# EAGLE design ownduino (EAGLE 6.1)
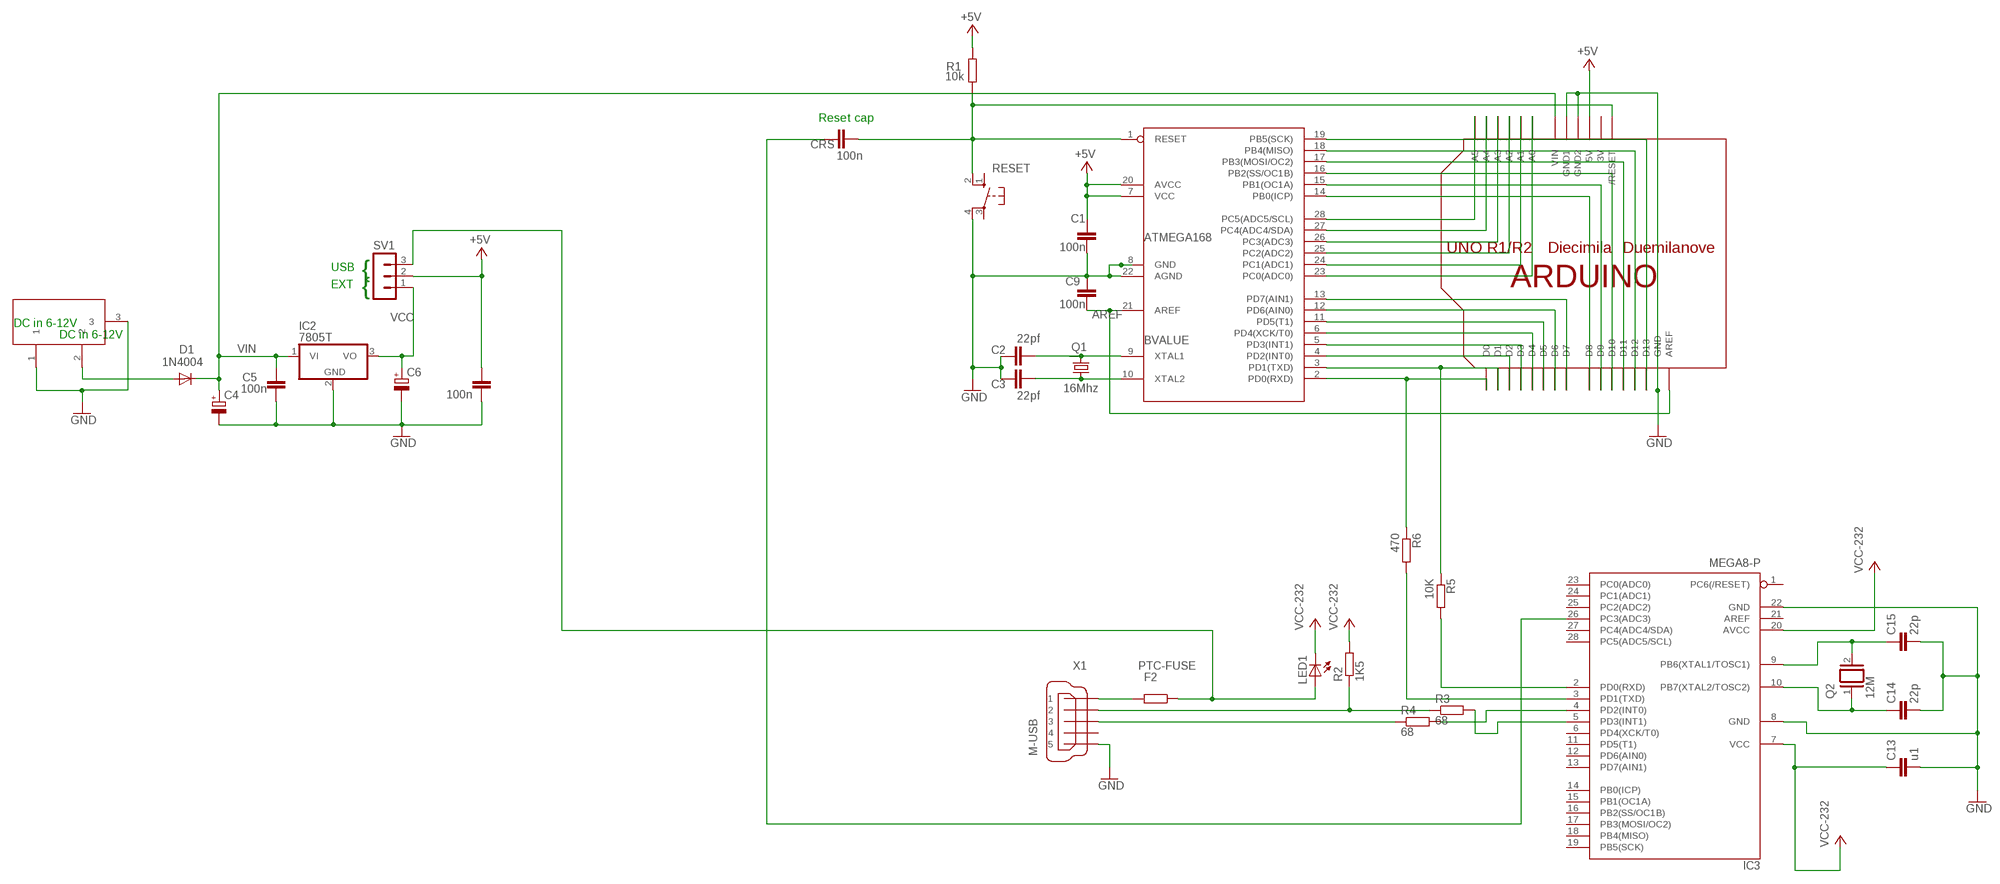
[diagram p0: schematic, sheet 1]

## Parts
BVALUE  ATMEGA168  MEGA8-P  [DIL28-3]
C1  100n  C-EU025-024X044  [C025-024X044]
C2  22pf  C-EU025-024X044  [C025-024X044]
C3  22pf  C-EU025-024X044  [C025-024X044]
C4  CPOL-EUE2.5-6  [E2,5-6]
C5  100n  C-EU025-024X044  [C025-024X044]
C6  CPOL-EUE2.5-6  [E2,5-6]
C9  100n  C-EU025-024X044  [C025-024X044]
C10  100n  C-EU025-024X044  [C025-024X044]
C13  u1  C-EU025-024X044  [C025-024X044]
C14  22p  C-EU025-024X044  [C025-024X044]
C15  22p  C-EU025-024X044  [C025-024X044]
CRS  100n  C-EU025-024X044  [C025-024X044]
D1  1N4004  DIODEPTH  [DIODE-0.4]
DC1  9V in  DC21MMX  [DC-21MM]
F2  PTC-FUSE  R-EU_0204/5  [0204/5]
IC2  7805T  [TO220H]
IC3  MEGA8-P  [DIL28-3]
LED1  LED3MM  [LED3MM]
Q1  16Mhz  CRYSTALHC49U-V  [HC49U-V]
Q2  12M  XTAL/S  [QS]
R1  10k  R-EU_0204/7  [0204/7]
R2  1K5  R-EU_0204/2V  [0204V]
R3  68  R-EU_0204/2V  [0204V]
R4  68  R-EU_0204/5  [0204/5]
R5  10K  R-EU_0204/7  [0204/7]
R6  470  R-EU_0204/7  [0204/7]
RESET  10-XX  [B3F-10XX]
SV1  MA03-1  [MA03-1]
U$1  ARDUINOUNO  [ARDUINO]
X1  M-USB  MINI-USB_SHIELD5P2-32005-601  [32005-601]

## Nets
+5V [power]: BVALUE.7(VCC) BVALUE.20(AVCC) C1.1 C10.2 R1.2 SV1.2 U$1.5V
A0: BVALUE.23(PC0(ADC0)) U$1.A0
A1: BVALUE.24(PC1(ADC1)) U$1.A1
A2: BVALUE.25(PC2(ADC2)) U$1.A2
A3: BVALUE.26(PC3(ADC3)) U$1.A3
A4: BVALUE.27(PC4(ADC4/SDA)) U$1.A4
A5: BVALUE.28(PC5(ADC5/SCL)) U$1.A5
AREF: BVALUE.21(AREF) C9.1 U$1.AREF
D0: BVALUE.2(PD0(RXD)) R6.1 U$1.D0
D1: BVALUE.3(PD1(TXD)) R5.1 U$1.D1
D2: BVALUE.4(PD2(INT0)) U$1.D2
D3: BVALUE.5(PD3(INT1)) U$1.D3
D4: BVALUE.6(PD4(XCK/T0)) U$1.D4
D5: BVALUE.11(PD5(T1)) U$1.D5
D6: BVALUE.12(PD6(AIN0)) U$1.D6
D7: BVALUE.13(PD7(AIN1)) U$1.D7
D8: BVALUE.14(PB0(ICP)) U$1.D8
D9: BVALUE.15(PB1(OC1A)) U$1.D9
D10: BVALUE.16(PB2(SS/OC1B)) U$1.D10
D11-MOSI: BVALUE.17(PB3(MOSI/OC2)) U$1.D11
D12-MISO: BVALUE.18(PB4(MISO)) U$1.D12
D13-SCK: BVALUE.19(PB5(SCK)) U$1.D13
D+: R4.1 X1.3
D-: R2.1 R3.1 X1.2
DTR: CRS.1 IC3.26(PC3(ADC3))
GND [power]: BVALUE.8(GND) BVALUE.22(AGND) C1.2 C2.1 C3.1 C4.- C5.1 C6.- C9.2 C10.1 C13.2 C14.2 C15.2 DC1.1 DC1.3 IC2.2(GND) IC3.8(GND) IC3.22(GND) RESET.4(P1) U$1.GND U$1.GND1 U$1.GND2 X1.5
N$1: C15.1 IC3.9(PB6(XTAL1/TOSC1)) Q2.2
N$4: C14.1 IC3.10(PB7(XTAL2/TOSC2)) Q2.1
N$6: BVALUE.9(XTAL1) C2.2 Q1.2
N$7 [power]: F2.1 LED1.A SV1.3
N$8 [power]: D1.A DC1.2
N$25: IC3.5(PD3(INT1)) R3.2
N$30: IC3.4(PD2(INT0)) R4.2
N$31: BVALUE.10(XTAL2) C3.2 Q1.1
N$33: IC3.2(PD0(RXD)) R5.2
N$35: IC3.3(PD1(TXD)) R6.2
N$38: F2.2 X1.1
RESET: BVALUE.1(RESET) CRS.2 R1.1 RESET.2(S1) U$1.RESET(/RESET)
VCC [power]: C6.+ C13.1 IC2.3(VO) IC3.7(VCC) IC3.20(AVCC) LED1.K(C) R2.2 SV1.1 ; supply symbol labelled VCC-232
VIN [power]: C4.+ C5.2 D1.C IC2.1(VI) U$1.VIN
Unconnected: IC3.1(PC6(/RESET)) IC3.6(PD4(XCK/T0)) IC3.11(PD5(T1)) IC3.12(PD6(AIN0)) IC3.13(PD7(AIN1)) IC3.14(PB0(ICP)) IC3.15(PB1(OC1A)) IC3.16(PB2(SS/OC1B)) IC3.17(PB3(MOSI/OC2)) IC3.18(PB4(MISO)) IC3.19(PB5(SCK)) IC3.21(AREF) IC3.23(PC0(ADC0)) IC3.24(PC1(ADC1)) IC3.25(PC2(ADC2)) IC3.27(PC4(ADC4/SDA)) IC3.28(PC5(ADC5/SCL)) RESET.1(S) RESET.3(P) X1.4 X1.M1(S1) X1.M2(S2)

## Notes on the sheet
- Reset cap
- USB
- {
- EXT
- {
- DC in 6-12V
- DC in 6-12V

## Power pins joined to a net without a drawn wire
3V: U$1.3V

## Library data of the parts
BVALUE = my-library:MEGA8-P: MICROCONTROLLER 8 Kbytes FLASH 1 kbytes SRAM 512 bytes EEPROM USART 4-channel 10 bit ADC 2-channel 8 bit ADC Source: avr.lbr
C1-C3 C5 C9 C10 C13-C15 CRS = rcl:C-EU: CAPACITOR, European symbol
C4 C6 = rcl:CPOL-EU: POLARIZED CAPACITOR, European symbol
D1 = SparkFunEagle-6-6-07:DIODE: Diode These are standard reverse protection diodes and small signal diodes. SMA package can handle up to about 1A. SOD-323 can handle about 200mA. What the SOD-323 package when ordering, there are some mfgs out there that are 5-pin packages.
DC1 = powersupply:DC21MM
F2 R1-R6 = rcl:R-EU_: RESISTOR, European symbol
IC2 = linear:78*: Positive VOLTAGE REGULATOR Source: http://cache.national.com/ds/LM/LM78L05.pdf http://www.fairchildsemi.com/ds/LM/LM7805.pdf
IC3 = atmel:MEGA8-P: MICROCONTROLLER 8 Kbytes FLASH, 1 kbytes SRAM, 512 bytes EEPROM, USART, 4-channel 10 bit ADC, 2-channel 8 bit ADC Pin compatible with Atmega48, ATMega88, ATMega168 Source: avr.lbr; OC_FARNELL: unknown; OC_NEWARK: unknown
LED1 = led:LED: LED OSRAM: - CHIPLED LG R971, LG N971, LY N971, LG Q971, LY Q971, LO R971, LY R971 LH N974, LH R974 LS Q976, LO Q976, LY Q976 LO Q996 - Hyper CHIPLED LW Q18S LB Q993, LB Q99A, LB R99A - SideLED LS A670, LO A670, LY A670, LG A670, LP A670 LB A673, LV A673, LT A673, LW A673 LH A674 LY A675 LS A676, LA A676, LO A676, LY A676, LW A676 LS A679, LY A679, LG A679 - Hyper Micro SIDELED® LS Y876, LA Y876, LO Y876, LY Y876 LT Y87S - SmartLED LW L88C, LW L88S LB L89C, LB L89S, LG L890 LS L89K, LO L89K, LY L89K LS L896, LA L896, LO L896, LY L896 - TOPLED LS T670, LO T670, LY T670, LG T670, LP T670 LSG T670, LSP T670, LSY T670, LOP T670, LYG T670 LG T671, LOG T671, LSG T671 LB T673, LV T673, LT T673, LW T673 LH T674 LS T676, LA T676, LO T676, LY T676, LB T676, LH T676, LSB T676, LW T676 LB T67C, LV T67C, LT T67C, LS T67K, LO T67K, LY T67K, LW E67C LS E67B, LA E67B, LO E67B, LY E67B, LB E67C, LV E67C, LT E67C LW T67C LS T679, LY T679, LG T679 LS T770, LO T770, LY T770, LG T770, LP T770 LB T773, LV T773, LT T773, LW T773 LH T774 LS E675, LA E675, LY E675, LS T675 LS T776, LA T776, LO T776, LY T776, LB T776 LHGB T686 LT T68C, LB T68C - Hyper Mini TOPLED® LB M676 - Mini TOPLED Santana® LG M470 LS M47K, LO M47K, LY M47K Source: http://www.osram.convergy.de LUXEON: - LUMILED® LXK2-PW12-R00, LXK2-PW12-S00, LXK2-PW14-U00, LXK2-PW14-V00 LXK2-PM12-R00, LXK2-PM12-S00, LXK2-PM14-U00 LXK2-PE12-Q00, LXK2-PE12-R00, LXK2-PE12-S00, LXK2-PE14-T00, LXK2-PE14-U00 LXK2-PB12-K00, LXK2-PB12-L00, LXK2-PB12-M00, LXK2-PB14-N00, LXK2-PB14-P00, LXK2-PB14-Q00 LXK2-PR12-L00, LXK2-PR12-M00, LXK2-PR14-Q00, LXK2-PR14-R00 LXK2-PD12-Q00, LXK2-PD12-R00, LXK2-PD12-S00 LXK2-PH12-R00, LXK2-PH12-S00 LXK2-PL12-P00, LXK2-PL12-Q00, LXK2-PL12-R00 Source: www.luxeon.com KINGBRIGHT: KA-3528ASYC Source: www.kingbright.com
Q1 = crystal:CRYSTAL: CRYSTAL
Q2 = special:XTAL/S: CRYSTAL
RESET = switch-omron:10-XX: OMRON SWITCH
SV1 = con-lstb:MA03-1: PIN HEADER
U$1 = adafruit:ARDUINO: Arduino Diecimila/Duemilanove Make a shield with ease, this package has all the named pins as well as the two mounting drill holes and an outline of the USB and DC power connector. The outline is on the DIMENSION layer, so if your board house uses it they will cut the outline to match. http://www.ladyada.net/library/pcb/eaglelibrary.html
X1 = con-cypressindustries:MINI-USB_SHIELD5P2-: MINI USB-B R/A DIP 5pol. Source: www.cypressindustries.com; OC_FARNELL: unknown; OC_NEWARK: unknown

## Net classes
0 default: width 0.203 mm, clearance 0.203 mm
1 power: width 0.6 mm, clearance 0.305 mm
2 finepitch: width 0.203 mm, clearance 0.203 mm

## Board
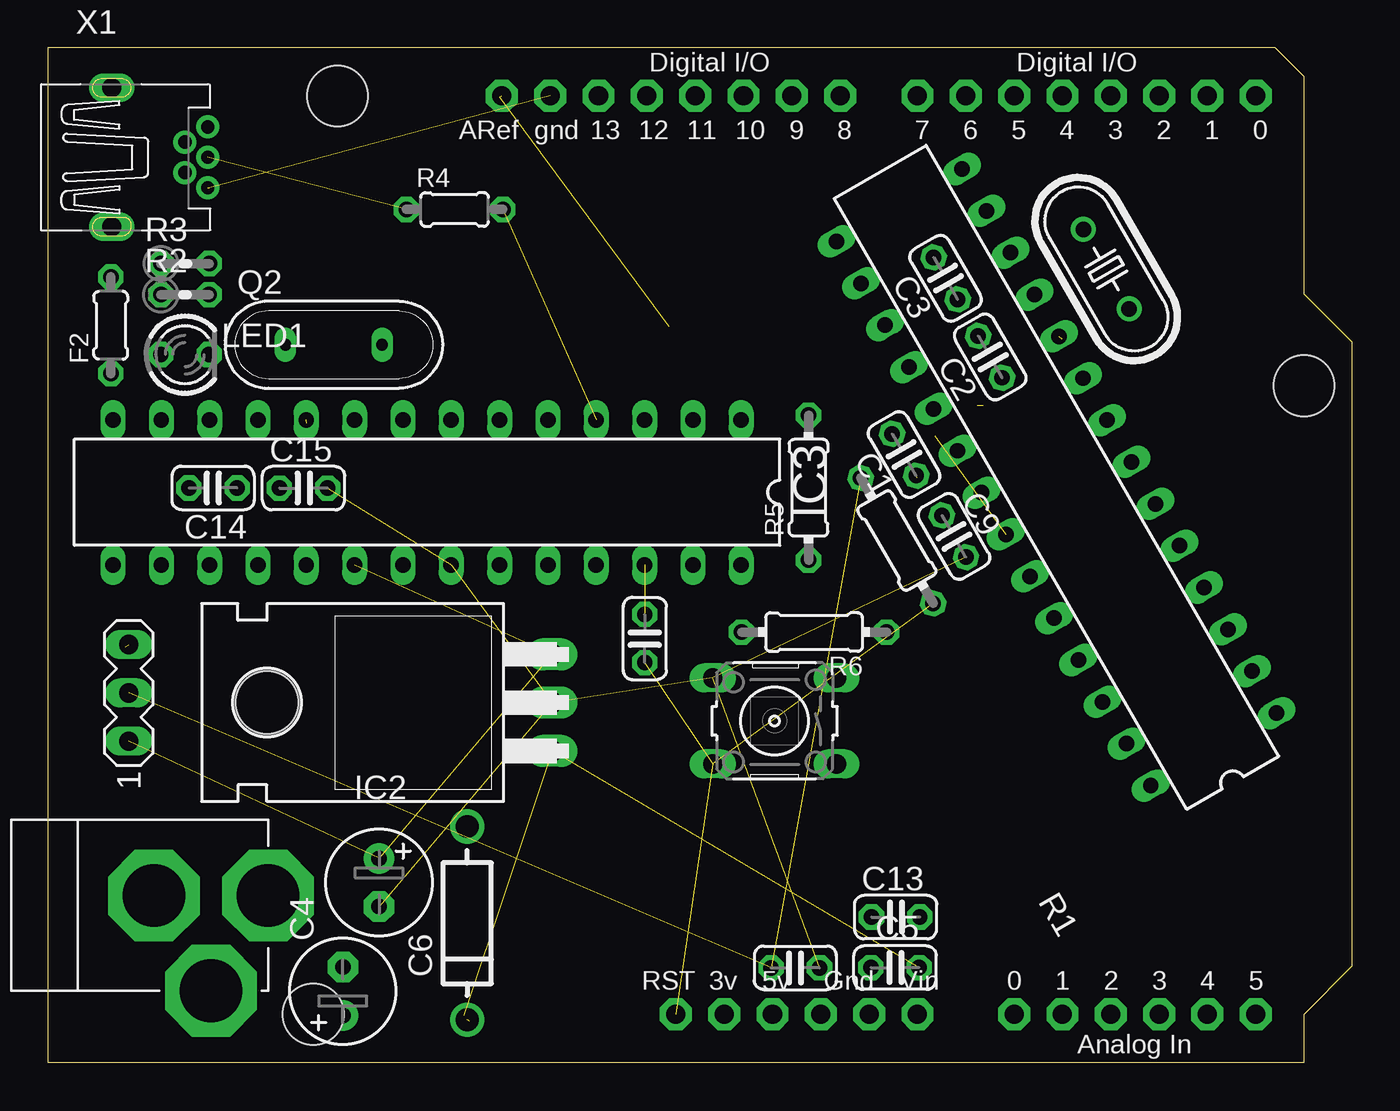
[diagram p1: board, top side]
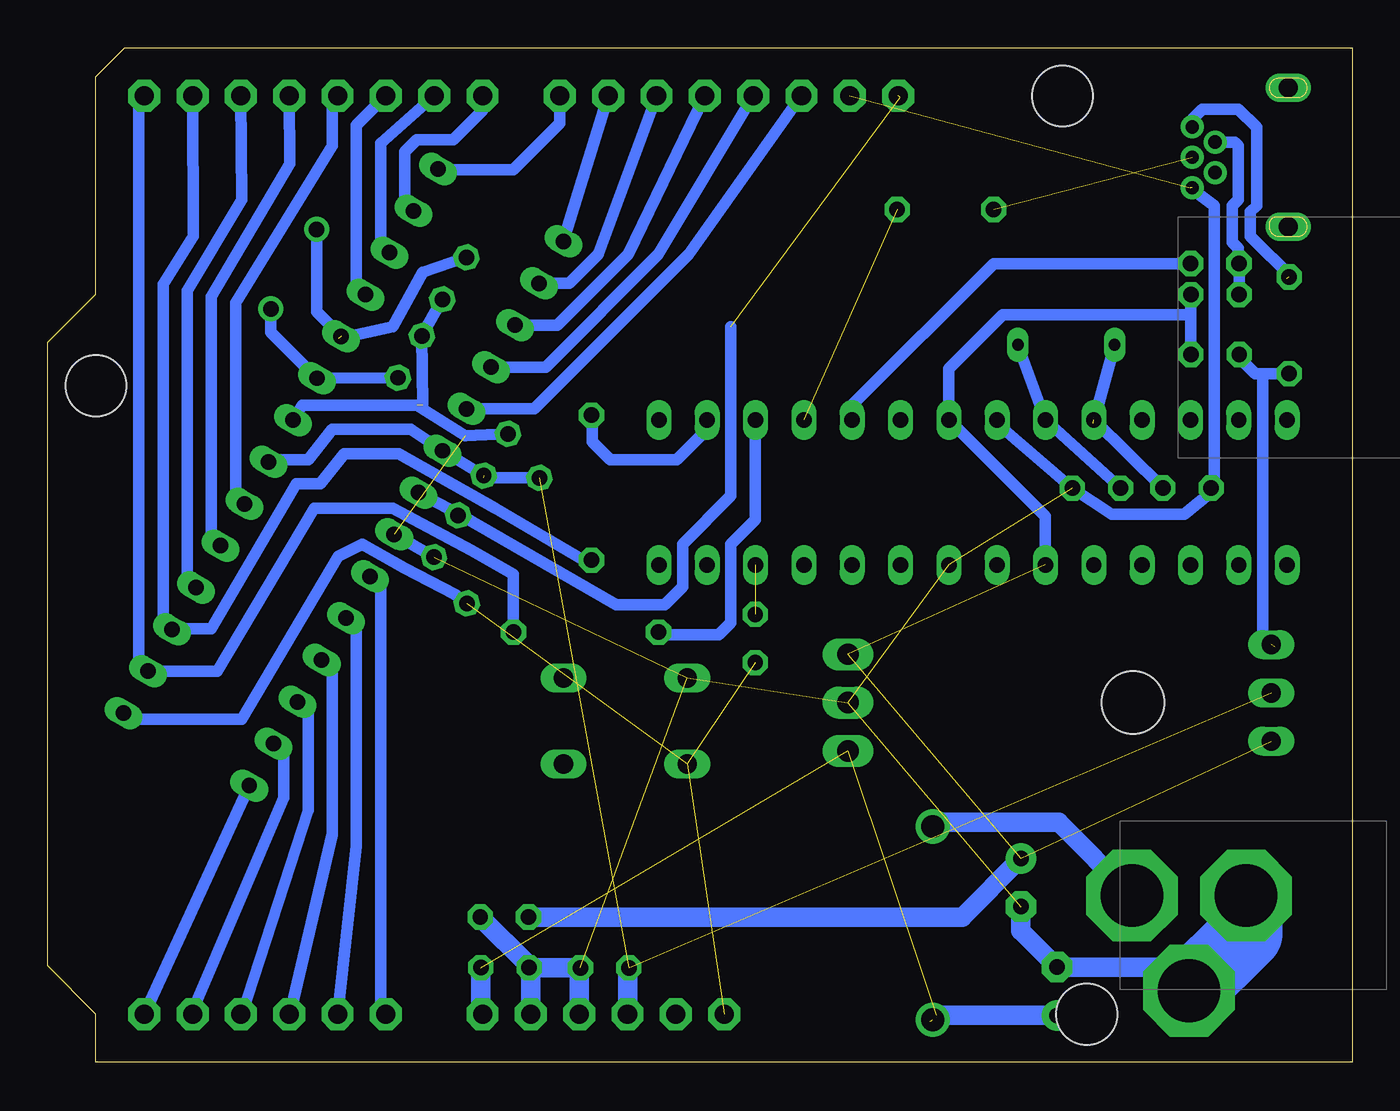
[diagram p2: board, bottom side, seen from below]

Size 68.58 x 53.34 mm. Coordinates in mm from the lower left corner, seen from the top.
Copper layers (1*16): Top 0.035mm / dielectric 1.5mm / Bottom 0.035mm
Design rules: minimum track width 10mil, minimum drill 0.6mm, track to track 8mil, track to pad 8mil, pad to pad 8mil, via to via 12mil, smd to smd 8mil, copper to edge 10mil, drill to drill 15mil, minimum pad ring 10mil, minimum via ring 12mil, stop-mask expansion 4mil, vias tented up to drill 0mil, thermal gap 10mil
Holes 3.2 mm at 67.03,138.64 67.03,110.7 16.23,153.88
tRestrict: area 14.3,152 to 18.1,155.8; area 65.1,136.7 to 68.9,140.5; area 65.1,108.8 to 68.9,112.6; 10 lines
bRestrict: area 14.3,152 to 18.1,155.8; area 65.1,136.7 to 68.9,140.5; area 65.1,108.8 to 68.9,112.6; 8 lines

### Footprints (pad centres in the part's own frame; a part is rotated, then mirrored left to right if it is on the bottom)
DIL28-3 = drill 0.813 long: 1 -16.51,-3.81; 2 -13.97,-3.81; 3 -11.43,-3.81; 4 -8.89,-3.81; 5 -6.35,-3.81; 6 -3.81,-3.81; 7 -1.27,-3.81; 8 1.27,-3.81; 9 3.81,-3.81; 10 6.35,-3.81; 11 8.89,-3.81; 12 11.43,-3.81; 13 13.97,-3.81; 14 16.51,-3.81; 15 16.51,3.81; 16 13.97,3.81; 17 11.43,3.81; 18 8.89,3.81; 19 6.35,3.81; 20 3.81,3.81; 21 1.27,3.81; 22 -1.27,3.81; 23 -3.81,3.81; 24 -6.35,3.81; 25 -8.89,3.81; 26 -11.43,3.81; 27 -13.97,3.81; 28 -16.51,3.81
C025-024X044 = drill 0.813 octagon: 1 -1.27,0; 2 1.27,0
E2,5-6 = drill 0.813 pad 1.6: + -1.27,0 | drill 0.813 pad 1.6 octagon: - 1.27,0
DIODE-0.4 = drill 1.2: A 0,0; C 10.16,0
DC-21MM = drill 3.302 pad 4.826 octagon: 1 -5.08,-3.353; 2 -0.076,-6.35; 3 -0.076,-0.356
0204/5 = drill 0.813 octagon: 1 -2.54,0; 2 2.54,0
TO220H = drill 1.118 long: 1 -2.54,-10.16; 2 0,-10.16; 3 2.54,-10.16 | hole 3.302: 0,4.826
LED3MM = drill 0.813 octagon: A -1.27,0; K 1.27,0
HC49U-V = drill 0.813: 1 -2.413,0; 2 2.413,0
QS = drill 0.61 long: 1 -2.54,0; 2 2.54,0
0204/7 = drill 0.813 octagon: 1 -3.81,0; 2 3.81,0
0204V = drill 0.813 octagon: 1 -1.27,0; 2 1.27,0
B3F-10XX = drill 1.016 long: 1 -3.251,2.261; 2 3.251,2.261; 3 -3.251,-2.261; 4 3.251,-2.261
MA03-1 = drill 1.016 long: 1 -2.54,0; 2 0,0; 3 2.54,0
ARDUINO = drill 1 pad 1.676 octagon: 3V 35.56,2.54; 5V 38.1,2.54; A0 50.8,2.54; A1 53.34,2.54; A2 55.88,2.54; A3 58.42,2.54; A4 60.96,2.54; A5 63.5,2.54; AREF 23.876,50.8; D0 63.5,50.8; D1 60.96,50.8; D2 58.42,50.8; D3 55.88,50.8; D4 53.34,50.8; D5 50.8,50.8; D6 48.26,50.8; D7 45.72,50.8; D8 41.656,50.8; D9 39.116,50.8; D10 36.576,50.8; D11 34.036,50.8; D12 31.496,50.8; D13 28.956,50.8; GND 26.416,50.8; GND1 43.18,2.54; GND2 40.64,2.54; RESET 33.02,2.54; VIN 45.72,2.54 | hole 3.2: 15.24,50.8; 66.04,35.56; 13.97,2.54
32005-601 = drill 0.7 pad 1.016: 1 2.825,1.6; 2 1.625,0.8; 3 2.825,0; 4 1.625,-0.8; 5 2.825,-1.6 | drill 1 pad 1.422 long: M1 -2.225,3.65; M2 -2.225,-3.65

### Placement (x,y rotation side)
BVALUE  53.03,30.76 120 top
C1  45.02,31.94 120 top
C2  49.54,37.09 300 top
C3  47.2,41.21 120 top
C4  15.52,3.74 90 top
C5  44.54,4.98 0 top
C6  17.42,9.46 270 top
C9  47.63,27.66 300 top
C10  39.3,4.98 180 top
C13  44.57,7.64 0 top
C14  8.7,30.19 180 top
C15  13.45,30.18 0 top
CRS  31.39,22.28 270 top
D1  22.05,12.4 270 top
DC1  5.24,8.85 90 top
F2  3.32,38.74 90 top
IC2  16.35,18.91 90 top
IC3  19.95,29.97 180 top
LED1  7.22,37.21 0 top
Q1  55.64,41.7 300 top
Q2  15.04,37.72 0 top
R1  44.64,27.43 120 top
R2  7.22,40.35 0 top
R3  7.23,41.99 0 top
R4  21.39,44.83 0 top
R5  39.99,30.21 90 top
R6  40.28,22.62 180 top
RESET  38.21,17.95 180 top
SV1  4.27,19.42 90 top
U$1  0,0 0 top
X1  5.59,47.57 0 top

### Tracks (layer width: path | path; a pad name or v marks a point on that pad's centre or on a via)
+5V  (3 unrouted)
  Bottom 0.61: C1.1 BVALUE.20 49.49,33.27 53.62,33.27 54.89,31.68 56.79,31.68 BVALUE.7 | R1.2 45.68,30.73
  Bottom 1.016: C10.2 38.1,4.91 U$1.5V
A0
  Bottom 0.61: BVALUE.23 51.3,25.55 51.08,25.33 51.08,2.82 U$1.A0
A1
  Bottom 0.61: BVALUE.24 52.59,23.35 52.35,23.11 52.35,11.36 53.3,2.79 53.3,2.58 U$1.A1
A2
  Bottom 0.61: BVALUE.25 53.88,21.15 53.62,20.88 53.62,11.99 55.84,2.47 55.84,2.58 U$1.A2
A3
  Bottom 0.61: BVALUE.26 55.44,18.9 54.89,18.35 54.89,13.26 58.38,2.47 U$1.A3
A4
  Bottom 0.61: BVALUE.27 56.47,16.75 56.16,16.44 56.16,13.9 60.92,2.79 U$1.A4
A5
  Bottom 0.61: BVALUE.28 U$1.A5
AREF  (2 unrouted)
  Bottom 0.61: BVALUE.21 46.95,28.82 | 46.95,28.82 C9.1 | 46.95,28.82 38.69,24.06 36.15,24.06 35.2,25.01 35.2,27.24 32.66,29.77 32.66,38.66
D0
  Bottom 0.61: U$1.D0 63.78,50.41 63.78,20.88 BVALUE.2 59.65,20.57 54.57,29.14 50.44,29.14 46.32,26.92 44.09,25.65 R6.1
D1
  Bottom 0.61: U$1.D1 60.92,43.43 62.51,40.89 62.51,23.11 | 62.51,23.11 BVALUE.3 | 62.51,23.11 62.19,22.79 59.97,22.79 55.52,30.41 54.25,30.41 52.98,32 50.12,32 45.05,29.14 40.4,26.4 R5.1
D2
  Bottom 0.61: U$1.D2 58.38,45.33 61.24,40.57 61.24,25.33 BVALUE.4
D3
  Bottom 0.61: BVALUE.5 59.58,27.16 59.97,27.55 59.97,40.25 55.84,47.24 U$1.D3
D4
  Bottom 0.61: U$1.D4 53.34,50.37 53.62,50.09 53.62,48.19 58.7,39.94 58.7,29.83 BVALUE.6
D5
  Bottom 0.61: U$1.D5 52.35,49.25 52.35,40.89 51.88,40.42 BVALUE.11
D6
  Bottom 0.61: U$1.D6 51.08,48.3 51.08,43.11 50.61,42.64 BVALUE.12
D7
  Bottom 0.61: BVALUE.13 49.81,45.23 49.81,47.87 49.17,48.51 47.27,48.51 45.72,50.06 U$1.D7
D8
  Bottom 0.61: U$1.D8 41.66,49.36 44.09,46.92 48.03,46.92 BVALUE.14
D9
  Bottom 0.61: U$1.D9 BVALUE.15
D10
  Bottom 0.61: BVALUE.16 41.17,40.95 39.65,42.48 U$1.D10
D11-MOSI
  Bottom 0.61: BVALUE.17 41.79,38.75 38.06,42.48 U$1.D11
D12-MISO
  Bottom 0.61: BVALUE.18 42.4,36.55 36.47,42.48 U$1.D12
D13-SCK
  Bottom 0.61: BVALUE.19 43.01,34.35 34.88,42.48 U$1.D13
D+  (1 unrouted)
D-
  Bottom 0.61: X1.2 6.17,48.37 5.99,48.19 5.99,45.33 6.31,45.02 6.31,43.11 5.99,42.79 5.99,42.02 R3.1 R2.1
DTR  (1 unrouted)
GND  (10 unrouted)
  Bottom 0.61: C3.1 C2.1 48.86,34.54 | BVALUE.22 C9.2 | C1.2 46.63,32.95 49.17,34.54 55.2,34.54 BVALUE.8 | IC3.8 18.69,33.59 C15.2 12.66,28.82 8.85,28.82 7.26,30.09 C14.2 7.43,30.25 7.26,30.73 7.26,45.02 8.53,45.97
  Bottom 1.016: DC1.1 9.83,5.01 C4.- 17.42,6.91 C6.- | C13.2 43.27,5.07 C5.1 43.26,4.98 | 43.26,4.98 C10.1 40.64,4.91 U$1.GND2 | 43.26,4.98 43.18,4.89 U$1.GND1
  Bottom 3.81: DC1.1 5.59,6.76 DC1.3
N$1
  Bottom 0.61: Q2.2 IC3.9 C15.1
N$4  (1 unrouted)
  Bottom 0.61: Q2.1 13.61,33.59 | C14.1 IC3.10
N$6
  Bottom 0.61: Q1.2 56.85,38.39 BVALUE.9 C2.2
N$7  (1 unrouted)
  Bottom 0.61: F2.1 4.72,36.2 | 4.72,36.2 5.12,36.2 5.99,37.08 5.95,37.12 LED1.A | 4.72,36.2 4.72,22.47 4.09,21.84
N$8
  Bottom 1.016: DC1.2 15.45,12.63 21.82,12.63 D1.A
N$25
  Bottom 0.61: R3.2 18.86,41.99 26.31,34.54 26.31,33.79 IC3.5
N$30  (1 unrouted)
N$31  (1 unrouted)
  Bottom 0.61: Q1.1 54.43,39.44 BVALUE.10 | C3.2 48.86,41.52 50.44,38.66 53.3,38.03 53.3,38.35
N$33
  Bottom 0.61: IC3.2 33.91,33.29 35.52,31.68 39.01,31.68 39.97,32.63 39.97,33.9 39.99,33.93 R5.2
N$35
  Bottom 0.61: IC3.3 31.37,28.52 32.66,27.24 32.66,23.11 33.3,22.47 36.47,22.47 R6.2
N$38  (1 unrouted)
  Bottom 0.61: X1.1 8.42,49.57 7.9,50.09 5.99,50.09 5.04,49.14 5.04,45.02 5.36,44.7 5.36,43.43 3.14,41.2 3.45,41.2
RESET  (3 unrouted)
  Bottom 0.61: BVALUE.1 64.25,18.03 58.38,18.03 53.3,26.6 52.03,27.24 49.81,25.96 47.18,24.61 R1.1
VCC  (3 unrouted)
  Bottom 0.61: 8.53,37.25 LED1.K 8.49,39.3 | 8.49,39.3 18.37,39.3 21.21,36.46 IC3.7 16.13,28.69 IC3.20 | R2.2 8.49,39.3
  Bottom 1.016: C6.+ 20.51,7.64 C13.1
VIN  (3 unrouted)
  Bottom 1.016: C4.+ 21.87,2.47 22.19,2.15 | U$1.VIN 45.81,2.63 C5.2

### Text on the board
tNames: F1
Edit History: 20070917 WestfW: Move (CC) symbol, use silk_gen to get 5mil widths | 20070917 WestfW: Manual route some, autoroute rest. Fiddle. | 20070917 WestfW: Now V1.16. Change components to TH. | 20070911 WestfW: Now V1.15. Move tracks slightly for shielding | 20070900 Daniel: Schematic and initial placement
_tsilk: C12 | C8 | 3 2 1 0 9 8 | 7 6 5 4 3 2 1 0 | RX | TX | 1 1 1 1 | Digital | X2 | AREF | GND | R7 | PWM | PWM | PWM | PWM | PWM | PWM | PWR | IC1 | 13 | Freeduino | FT232RL | c | c | R10 | V1.16 | TX | R8 | RX | 16Mhz | 1 | R1 | R9 | C3 | C10 | R12 | ]USB | R11 | ]EXT | F1 | Q1 | C2 | ICSP | RESET | 1 | CRS | M. Banzi | D. Cuartielles | D. Mellis | N. Zambetti | C5 | C4 | ATMEGA168 | IC2 | D1 | C1 | 47u | C7 | 47u | C6 | C9 | Analog in | 5V Gnd 9V | RESET | 3.3V | 0 1 2 3 4 5 | 9V in